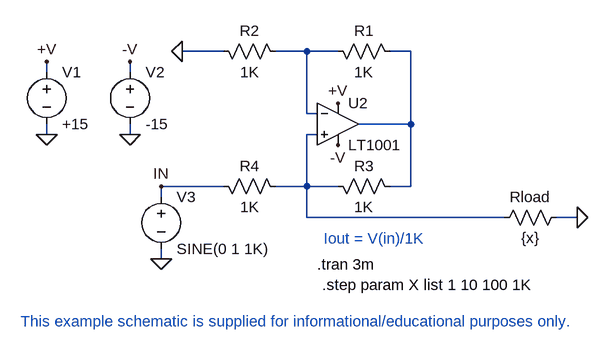
[diagram p0: schematic Fig_9-7_Howland_P.asc]
Fig_9-7_Howland_P.asc, the LTspice schematic file:
Version 4
SHEET 1 880 696
WIRE 16 160 -48 160
WIRE 144 160 96 160
WIRE 192 160 144 160
WIRE 304 160 272 160
WIRE -256 192 -256 176
WIRE -128 192 -128 176
WIRE 144 256 144 160
WIRE 160 256 144 256
WIRE 304 272 304 160
WIRE 304 272 224 272
WIRE -256 288 -256 272
WIRE -128 288 -128 272
WIRE 160 288 144 288
WIRE 16 368 -80 368
WIRE 144 368 144 288
WIRE 144 368 96 368
WIRE 192 368 144 368
WIRE 304 368 304 272
WIRE 304 368 272 368
WIRE -80 384 -80 368
WIRE 144 416 144 368
WIRE 448 416 144 416
WIRE 560 416 528 416
WIRE -80 480 -80 464
FLAG -128 288 0
FLAG -256 288 0
FLAG 192 240 +V
FLAG -256 176 +V
FLAG -128 176 -V
FLAG 192 304 -V
FLAG -80 480 0
FLAG -80 368 IN
FLAG -48 160 0
FLAG 560 416 0
SYMBOL voltage -256 176 R0
SYMATTR InstName V1
SYMATTR Value +15
SYMBOL voltage -128 176 R0
SYMATTR InstName V2
SYMATTR Value -15
SYMBOL res 176 144 M90
WINDOW 0 0 56 VBottom 2
WINDOW 3 32 56 VTop 2
SYMATTR InstName R1
SYMATTR Value 1K
SYMBOL res 0 144 M90
WINDOW 0 0 56 VBottom 2
WINDOW 3 32 56 VTop 2
SYMATTR InstName R2
SYMATTR Value 1K
SYMBOL voltage -80 368 R0
WINDOW 123 0 0 Left 2
WINDOW 39 0 0 Left 2
SYMATTR InstName V3
SYMATTR Value SINE(0 1 1K)
SYMBOL res 176 352 M90
WINDOW 0 0 56 VBottom 2
WINDOW 3 32 56 VTop 2
SYMATTR InstName R3
SYMATTR Value 1K
SYMBOL res 0 352 M90
WINDOW 0 0 56 VBottom 2
WINDOW 3 32 56 VTop 2
SYMATTR InstName R4
SYMATTR Value 1K
SYMBOL res 432 432 R270
WINDOW 0 32 56 VTop 2
WINDOW 3 0 56 VBottom 2
SYMATTR InstName Rload
SYMATTR Value {x}
SYMBOL opamps\\LT1001 192 208 R0
SYMATTR InstName U2
TEXT 160 488 Left 2 !.tran 3m
TEXT 168 520 Left 2 !.step param X list 1 10 100 1K
TEXT 248 464 Bottom 2 ;Iout = V(in)/1K
TEXT -296 576 Left 2 ;This example schematic is supplied for informational/educational purposes only.

The netlist it stands for:
* Fig_9-7_Howland_P.asc
V1 +V 0 +15
V2 -V 0 -15
R1 N001 N002 1K
R2 0 N001 1K
V3 IN 0 SINE(0 1 1K)
R3 N003 N002 1K
R4 IN N003 1K
Rload N003 0 {x}
XU2 N003 N001 +V -V N002 LT1001  ; pins In+ In- V+ V- OUT
.tran 3m
.step param X list 1 10 100 1K
* Iout = V(in)/1K
* This example schematic is supplied for informational/educational purposes only.
.lib LTC.lib
.backanno
.end